# Altium schematic sheet MidPower.SchDoc
size A4
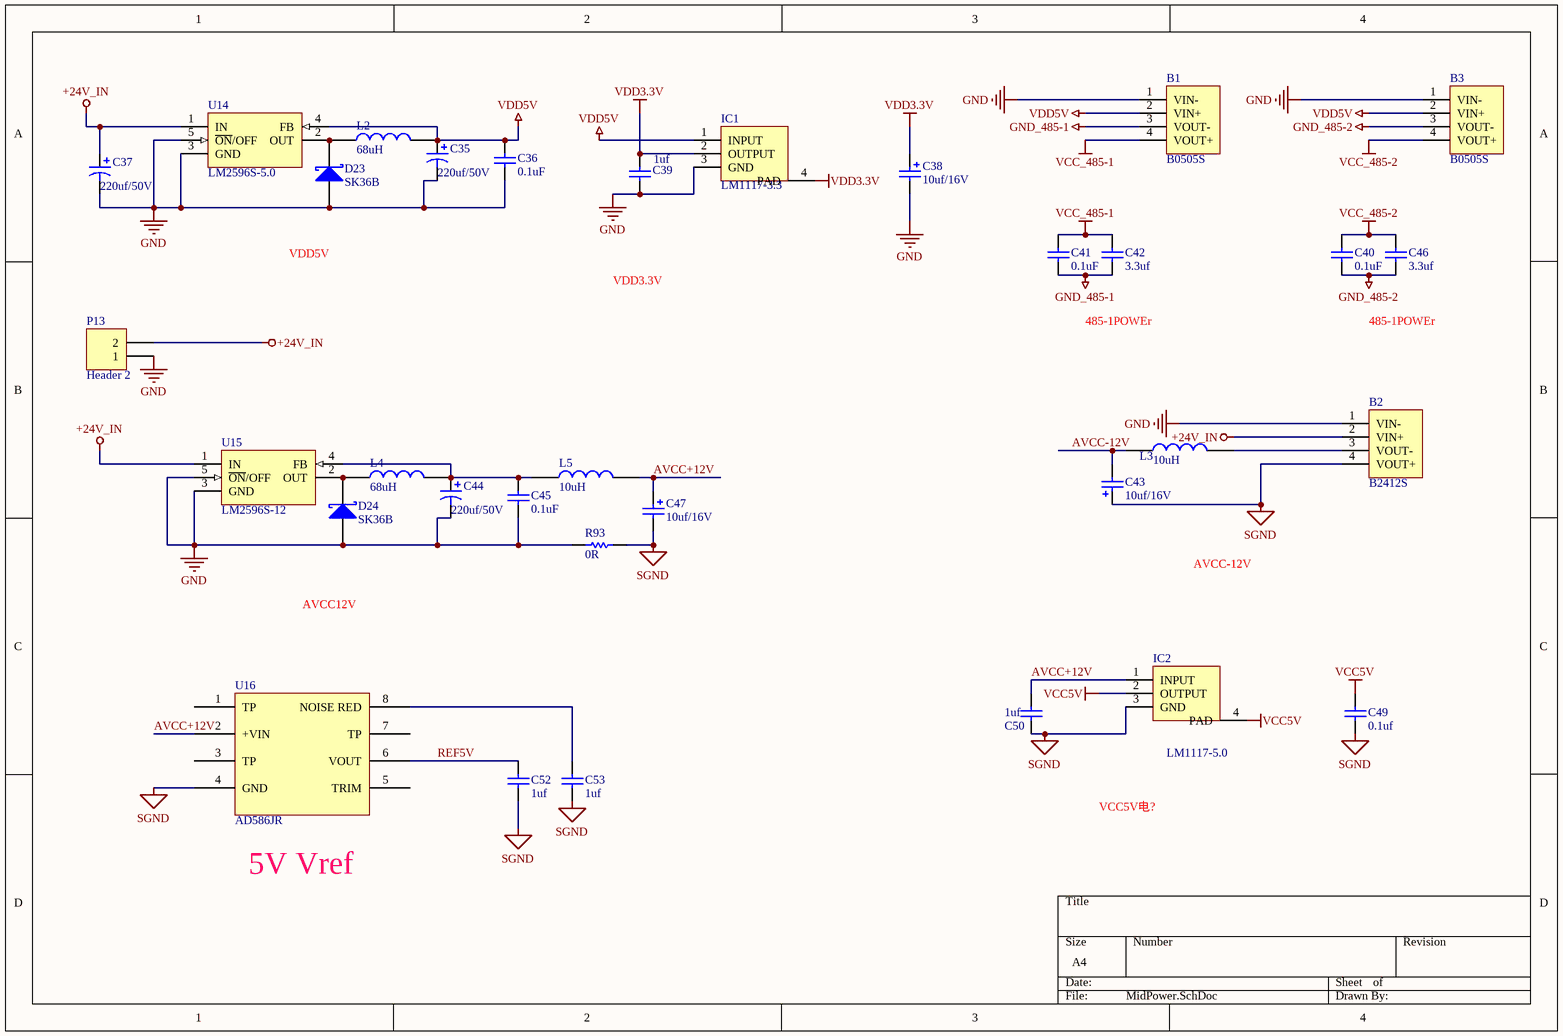
[diagram p0: MidPower.SchDoc]

## Parts
B1  B0505S  [B0505S]
B2  B2412S  [B0505S]
B3  B0505S  [B0505S]
C35  value 220uf/50V  [Cap5*10*12]  (hidden comment: Cap Pol1)
C36  value 0.1uF  [C0805]  (hidden comment: Cap)
C37  value 220uf/50V  [Cap5*10*12]  (hidden comment: Cap Pol1)
C38  value 10uf/16V  [C3216]
C39  value 1uf  [C0805]  (hidden comment: Cap)
C40  value 0.1uF  [C0805]  (hidden comment: Cap)
C41  value 0.1uF  [C0805]  (hidden comment: Cap)
C42  value 3.3uf  [C0805]  (hidden comment: Cap)
C43  value 10uf/16V  [C3216]
C44  value 220uf/50V  [Cap5*10*12]  (hidden comment: Cap Pol1)
C45  value 0.1uF  [C0805]  (hidden comment: Cap)
C46  value 3.3uf  [C0805]  (hidden comment: Cap)
C47  value 10uf/16V  [C3216]
C49  value 0.1uf  [C0805]  (hidden comment: Cap)
C50  value 1uf  [C0805]  (hidden comment: Cap)
C52  value 1uf  [C0805]  (hidden comment: Cap)
C53  value 1uf  [C0805]  (hidden comment: Cap)
D23  SK36B  [SMB]
D24  SK36B  [SMB]
IC1  LM1117-3.3  [LM1117]
IC2  LM1117-5.0  [LM1117]
L2  68uH  [IND_HM00_12*12]
L3  10uH  [INDM4532N]
L4  68uH  [IND_HM00_12*12]
L5  10uH  [INDM4532N]
P13  Header 2  [3.5-P2]
R93  value 0R  [0805]  (hidden comment: Res Semi)
U14  LM2596S-5.0  [TS5B_M]
U15  LM2596S-12  [TS5B_M]
U16  AD586JR  [SOP8_M]

## Nets
+24V_IN: B2.2(VIN+) C37.1 P13.2 U14.1(IN) U15.1(IN)
GND: B1.1(VIN-) B2.1(VIN-) B3.1(VIN-) C35.2 C36.1 C37.2 C38.2 C39.2 C44.2 C45.1 D23.1(A) D24.1(A) IC1.3(GND) P13.1 R93.2 U14.3(GND) U14.5(~{ON}/OFF) U15.3(GND) U15.5(~{ON}/OFF)
GND_485-1: B1.3(VOUT-) C41.1 C42.1
GND_485-2: B3.3(VOUT-) C40.1 C46.1
SGND: B2.4(VOUT+) C43.1 C47.2 C49.2 C50.2 C52.2 C53.2 IC2.3(GND) R93.1 U16.4(GND)
VCC5V: C49.1 IC2.2(OUTPUT) IC2.4(PAD)
VCC_485-1: B1.4(VOUT+) C41.2 C42.2
VCC_485-2: B3.4(VOUT+) C40.2 C46.2
VDD3.3V: C38.1 C39.1 IC1.2(OUTPUT) IC1.4(PAD)
VDD5V: B1.2(VIN+) B3.2(VIN+) C35.1 C36.2 IC1.1(INPUT) L2.2 U14.4(FB)
AVCC+12V: C47.1 C50.1 IC2.1(INPUT) L5.2 U16.2(+VIN)
AVCC-12V: C43.2 L3.1
REF5V: C52.1 U16.6(VOUT)
NetB2_3: B2.3(VOUT-) L3.2
NetC44_1: C44.1 C45.2 L4.2 L5.1 U15.4(FB)
NetC53_1: C53.1 U16.8(NOISE_RED)
NetD23_2: D23.2(K) L2.1 U14.2(OUT)
NetD24_2: D24.2(K) L4.1 U15.2(OUT)

Not connected (* = marked no-connect by the designer): U16 1(TP) 3(TP) 5(TRIM) 7(TP)

## Notes on the sheet
- VDD5V
- VDD3.3V
- 485-1POWEr
- AVCC-12V
- AVCC12V
- VCC5V电?
- 5V Vref

## Library data of the parts
B2 = B0505S
C35 C37 C44 = Cap Pol1: Polarized Capacitor (Radial); Published: 8-Jun-2000; LatestRevisionDate: 17-Jul-2002; LatestRevisionNote: Re-released for DXP Platform.; PackageReference: RB7.6-15; Publisher: Altium Limited
C36 C40-C42 C45 C46 = Cap_2: Capacitor; Published: 8-Jun-2000; LatestRevisionDate: 17-Jul-2002; LatestRevisionNote: Re-released for DXP Platform.; Publisher: Altium Limited
C38 C43 C47 = Cap Pol2: Polarized Capacitor (Axial); Published: 8-Jun-2000; LatestRevisionDate: 17-Jul-2002; LatestRevisionNote: Re-released for DXP Platform.; PackageReference: POLAR0.8; Publisher: Altium Limited; PackageDescription: Polarized Capacitor; 2 Leads
C39 C49 C50 C52 C53 = Cap: Capacitor; Manufacturer: Generic Components; Class: Passive; Published: 08/06/2000; Publisher: Altium Hobart Technology Centre; SubClass: Capacitor
D23 D24 = D Schottky: Schottky Diode; Published: 8-Jun-2000; LatestRevisionDate: 17-Jul-2002; LatestRevisionNote: Re-released for DXP Platform.; PackageReference: SMB; Publisher: Altium Limited; Code_JEDEC: DO-214-AA
IC1 IC2 = LM1117
L2-L5 = INDUCTOR
P13 = Header 2: Header, 2-Pin; LatestRevisionDate: 17-Jul-2002; LatestRevisionNote: Re-released for DXP Platform.; Publisher: Altium Limited
R93 = Res Semi: Semiconductor Resistor; Published: 8-Jun-2000; LatestRevisionDate: 17-Jul-2002; LatestRevisionNote: Re-released for DXP Platform.; PackageReference: AXIAL-0.5; Publisher: Altium Limited
U14 = LM2596S-5.0: Simple Switcher Power Converter 150 kHz 3A Step Down Voltage Regulator; Note: Tab is connected to GND; Published: 15-Apr-2002; DatasheetVersion: Dec-1997; PackageReference: TS5B; Publisher: Altium Limited; PackageDescription: D2-PAK; 5 Leads; Body 14.4 (inc. leads) x 10.4 mm (LxW max); ComponentLink1Description: Manufacturer Link; ComponentLink1URL: http://www.national.com/; ComponentLink2Description: Datasheet; ComponentLink2URL: http://www.national.com/ds.cgi/LM/LM2596.pdf; ComponentLink3Description: URL Link1; ComponentLink3URL: http://www.national.com/pf/LM/LM2596.html
U15 = LM2596S-12: Simple Switcher Power Converter 150 kHz 3A Step Down Voltage Regulator; Note: Tab is connected to GND; Published: 15-Apr-2002; DatasheetVersion: Dec-1997; PackageReference: TS5B; Publisher: Altium Limited; PackageDescription: D2-PAK; 5 Leads; Body 14.4 (inc. leads) x 10.4 mm (LxW max); ComponentLink1Description: Manufacturer Link; ComponentLink1URL: http://www.national.com/; ComponentLink2Description: Datasheet; ComponentLink2URL: http://www.national.com/ds.cgi/LM/LM2596.pdf; ComponentLink3Description: URL Link1; ComponentLink3URL: http://www.national.com/pf/LM/LM2596.html
U16 = AD586L